# EAGLE schematic node4-frontend (EAGLE 4.16)
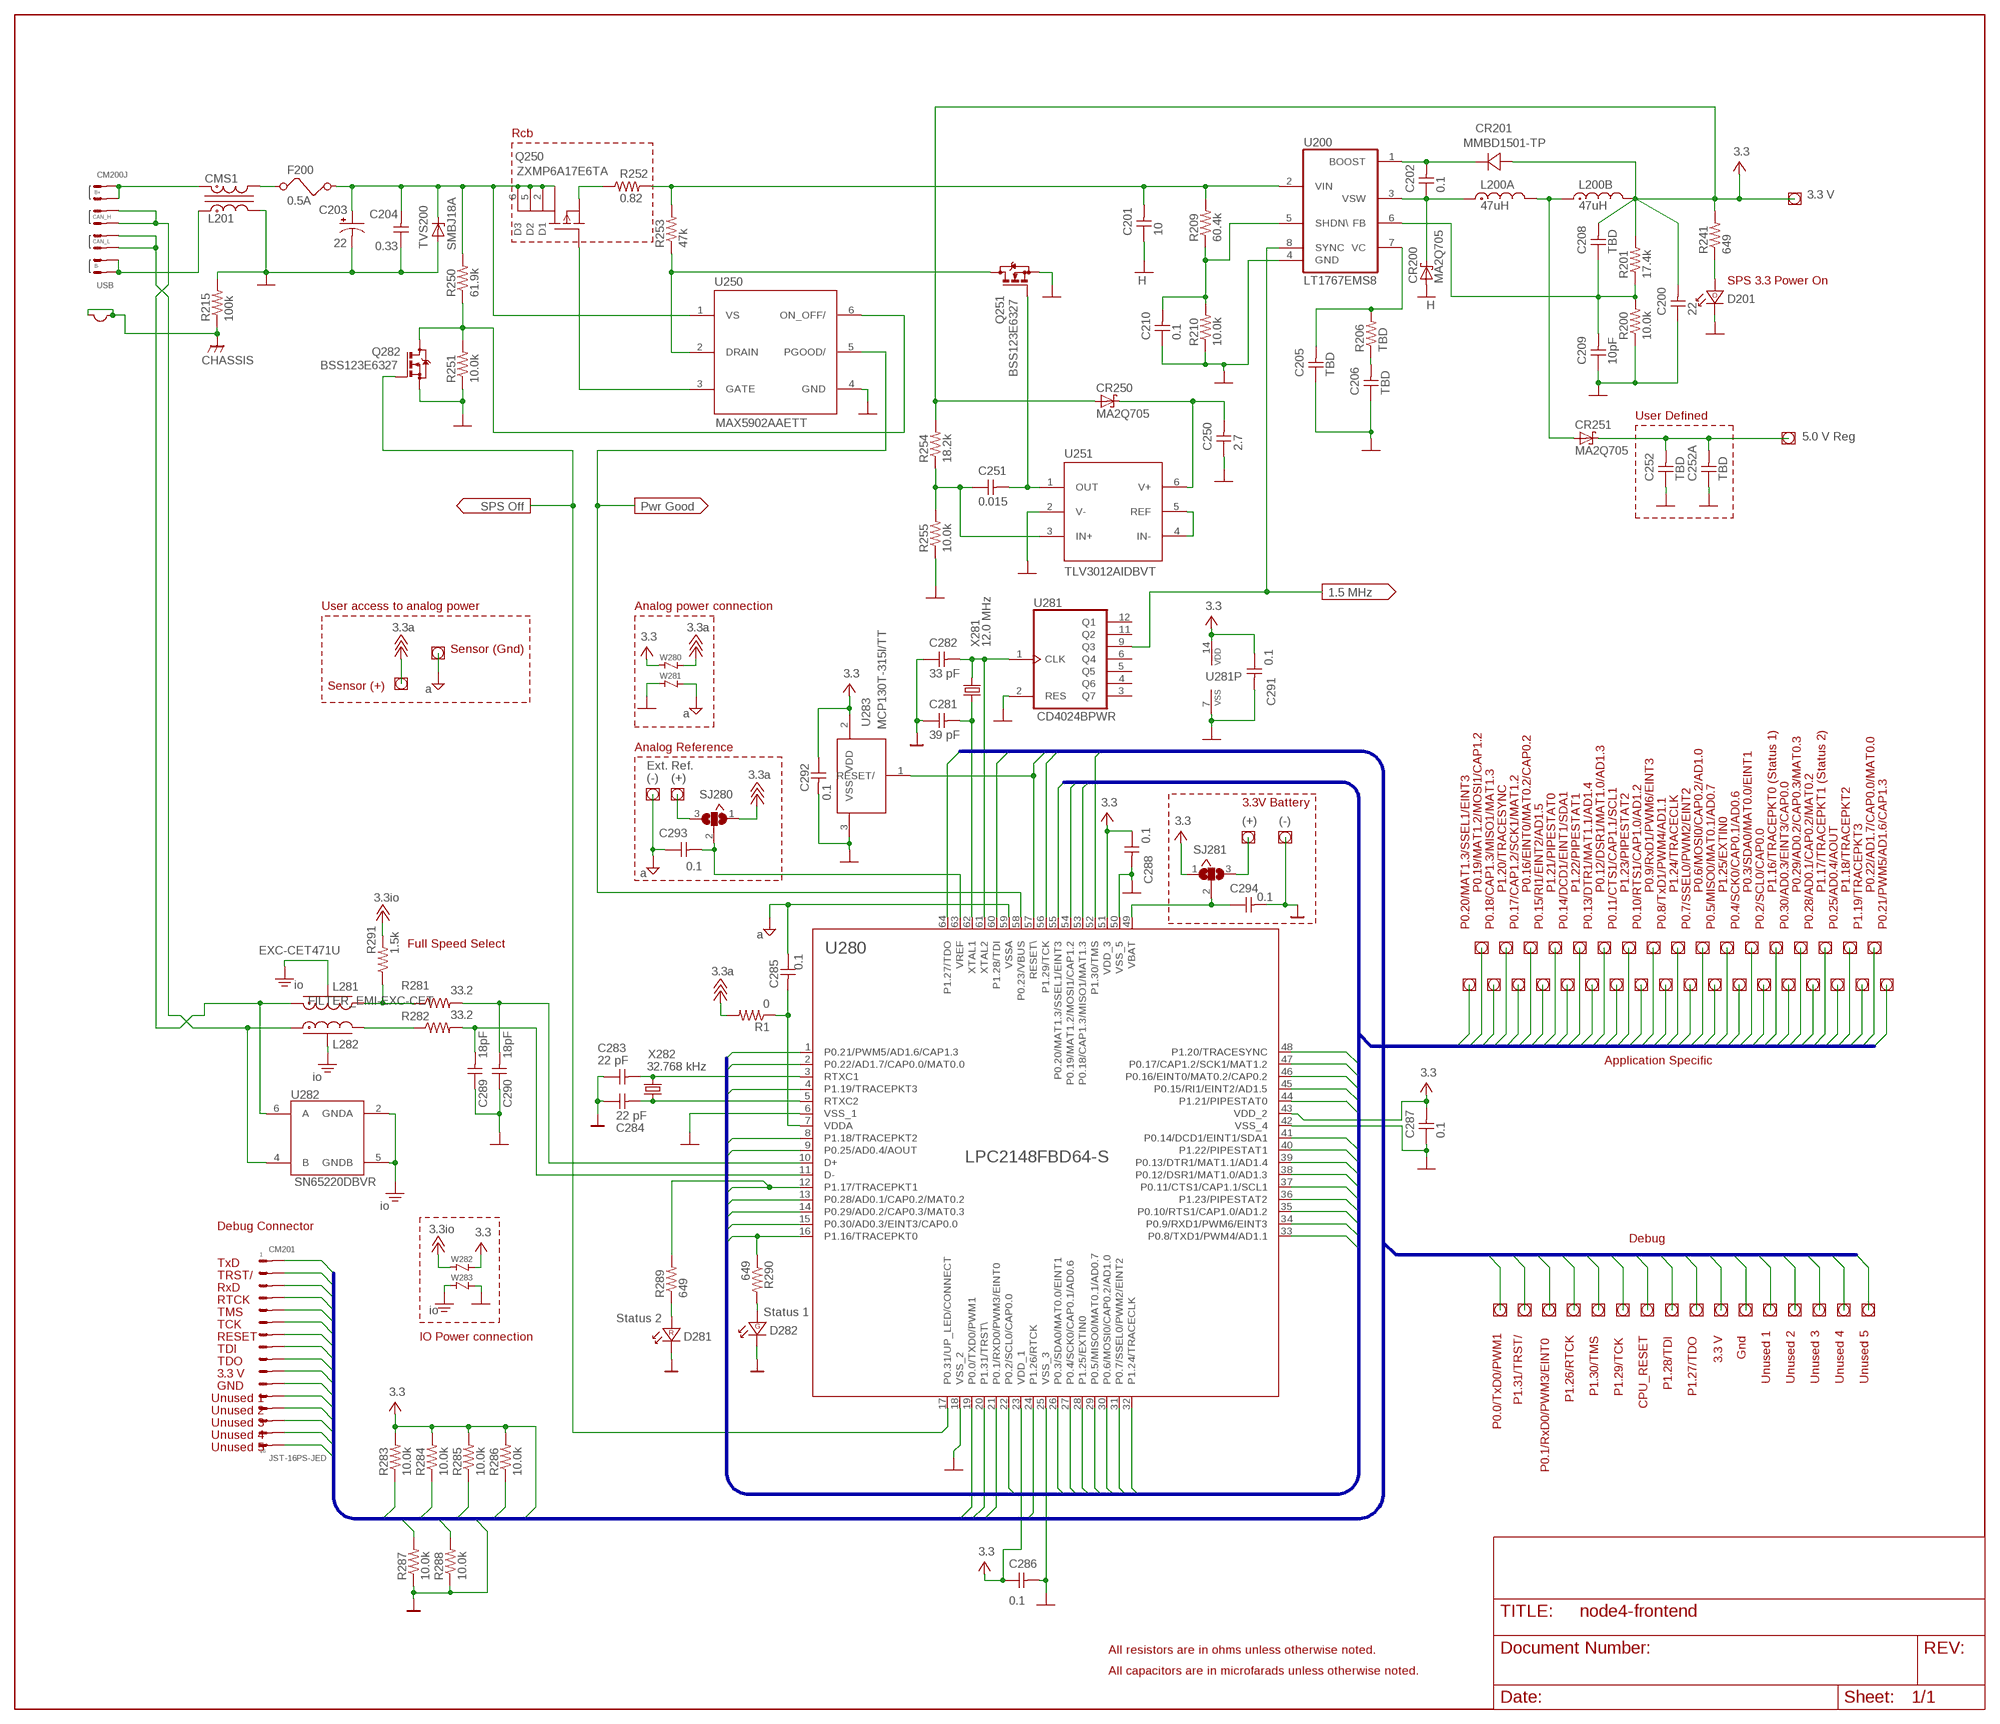
[diagram p0: schematic, sheet 1]

## Parts
3P3  3P3  CONN_JUMPPOINT  [PAD_SQUARE_APC-FREE_0.1/028]
C200  22  CAP-NP0805  [C0805]
C201  10  CAP-NP1206  [C1206]
C202  0.1  CAP-NP0805  [C0805]
C203  22  CPOL-USD/7343-31R  [D/7343-31R]
C204  0.33  CAP-NP0805  [C0805]
C205  TBD  CAP-NP0805  [C0805]
C206  TBD  CAP-NP0805  [C0805]
C208  TBD  CAP-NP0805  [C0805]
C209  10pF  CAP-NP0805  [C0805]
C210  0.1  CAP-NP0805  [C0805]
C250  2.7  CAP-NP0805  [C0805]
C251  0.015  CAP-NP0805  [C0805]
C252  TBD  CAP-NP0805  [C0805]
C252A  TBD  CAP-NP1206  [C1206]
C281  39 pF  CAP-NP0805  [C0805]
C282  33 pF  CAP-NP0805  [C0805]
C283  22 pF  CAP-NP0805  [C0805]
C284  22 pF  CAP-NP0805  [C0805]
C285  0.1  CAP-NP0805  [C0805]
C286  0.1  CAP-NP0805  [C0805]
C287  0.1  CAP-NP0805  [C0805]
C288  0.1  CAP-NP0805  [C0805]
C289  18pF  CAP-NP0805  [C0805]
C290  18pF  CAP-NP0805  [C0805]
C291  0.1  CAP-NP0805  [C0805]
C292  0.1  CAP-NP0805  [C0805]
C293  0.1  CAP-NP0805  [C0805]
C294  0.1  CAP-NP0805  [C0805]
CM200  USB  CONN_CAN_NODE  [CAN_NODE]
CM201  JST-16PS-JED  [JST-16PS-JED]
CR200  MA2Q705  [NMINIP2-J1]
CR201  MMBD1501-TP  DIODE_MMBD1501-TP  [SOT23-3]
CR250  MA2Q705  [NMINIP2-J1]
CR251  MA2Q705  [NMINIP2-J1]
D201  LED-ORG-0805  [0805-DIODE]
D281  LED-RED-0603  [0603-DIODE]
D282  LED-GRN-  [0603-DIODE]
F200  0.5A  FUSE1206  [1206]
L200A  47uH  COIL_SD31  [SD31]
L200B  47uH  COIL_SD31  [SD31]
L201  CMS1  COIL_CMS1  [CMS1]
L281  EXC-CET471U  FILTER_EMI-EXC-CET  [EXC-CET]
L282  FILTER_EMI-EXC-CET  [EXC-CET]
Q250  ZXMP6A17E6TA  FET_ZXMP6A17E6  [SOT23-6]
Q251  BSS123E6327  IC_BSS123  [SOT23-3]
Q282  BSS123E6327  IC_BSS123  [SOT23-3]
R1  0  R-US_R0805  [R0805]
R200  10.0k  R-US_R0805  [R0805]
R201  17.4k  R-US_R0805  [R0805]
R206  TBD  R-US_R0805  [R0805]
R209  60.4k  R-US_R0805  [R0805]
R210  10.0k  R-US_R0805  [R0805]
R215  100k  R-US_R0805  [R0805]
R241  649  R-US_M0805  [M0805]
R250  61.9k  R-US_R0805  [R0805]
R251  10.0k  R-US_R0805  [R0805]
R252  0.82  R-US_R0805  [R0805]
R253  47k  R-US_R0805  [R0805]
R254  18.2k  R-US_R0805  [R0805]
R255  10.0k  R-US_R0805  [R0805]
R281  33.2  R-US_R0805  [R0805]
R282  33.2  R-US_R0805  [R0805]
R283  10.0k  R-US_R1206  [R1206]
R284  10.0k  R-US_R1206  [R1206]
R285  10.0k  R-US_R1206  [R1206]
R286  10.0k  R-US_R1206  [R1206]
R287  10.0k  R-US_R1206  [R1206]
R288  10.0k  R-US_R1206  [R1206]
R289  649  R-US_R1206  [R1206]
R290  649  R-US_R1206  [R1206]
R291  1.5k  R-US_R0805  [R0805]
RA1  t24  CONN_JUMPPOINT  [PAD_SQUARE_APC-FREE_0.1/028]
RA2  t24  CONN_JUMPPOINT  [PAD_SQUARE_APC-FREE_0.1/028]
RA3  t24  CONN_JUMPPOINT  [PAD_SQUARE_APC-FREE_0.1/028]
RA4  Sensor (+)  CONN_JUMPPOINT  [PAD_SQUARE_APC-FREE_0.1/028]
RA5  t24  CONN_JUMPPOINT  [PAD_SQUARE_APC-FREE_0.1/028]
RA6  t24  CONN_JUMPPOINT  [PAD_SQUARE_APC-FREE_0.1/028]
RA7  t24  CONN_JUMPPOINT  [PAD_SQUARE_APC-FREE_0.1/028]
RA8  t24  CONN_JUMPPOINT  [PAD_SQUARE_APC-FREE_0.1/028]
RA9  t24  CONN_JUMPPOINT  [PAD_SQUARE_APC-FREE_0.1/028]
RA10  t24  CONN_JUMPPOINT  [PAD_SQUARE_APC-FREE_0.1/028]
RA11  t24  CONN_JUMPPOINT  [PAD_SQUARE_APC-FREE_0.1/028]
RA12  t24  CONN_JUMPPOINT  [PAD_SQUARE_APC-FREE_0.1/028]
RA13  t24  CONN_JUMPPOINT  [PAD_SQUARE_APC-FREE_0.1/028]
RA14  t24  CONN_JUMPPOINT  [PAD_SQUARE_APC-FREE_0.1/028]
RA15  t24  CONN_JUMPPOINT  [PAD_SQUARE_APC-FREE_0.1/028]
RA16  t24  CONN_JUMPPOINT  [PAD_SQUARE_APC-FREE_0.1/028]
RA17  t24  CONN_JUMPPOINT  [PAD_SQUARE_APC-FREE_0.1/028]
RA18  t24  CONN_JUMPPOINT  [PAD_SQUARE_APC-FREE_0.1/028]
RA19  t24  CONN_JUMPPOINT  [PAD_SQUARE_APC-FREE_0.1/028]
RA20  t24  CONN_JUMPPOINT  [PAD_SQUARE_APC-FREE_0.1/028]
RA21  t24  CONN_JUMPPOINT  [PAD_SQUARE_APC-FREE_0.1/028]
RA22  t24  CONN_JUMPPOINT  [PAD_SQUARE_APC-FREE_0.1/028]
RA23  t24  CONN_JUMPPOINT  [PAD_SQUARE_APC-FREE_0.1/028]
RA24  t24  CONN_JUMPPOINT  [PAD_SQUARE_APC-FREE_0.1/028]
RA25  t24  CONN_JUMPPOINT  [PAD_SQUARE_APC-FREE_0.1/028]
RA26  t24  CONN_JUMPPOINT  [PAD_SQUARE_APC-FREE_0.1/028]
RA27  t24  CONN_JUMPPOINT  [PAD_SQUARE_APC-FREE_0.1/028]
RA28  t24  CONN_JUMPPOINT  [PAD_SQUARE_APC-FREE_0.1/028]
RA29  t24  CONN_JUMPPOINT  [PAD_SQUARE_APC-FREE_0.1/028]
RA30  t24  CONN_JUMPPOINT  [PAD_SQUARE_APC-FREE_0.1/028]
RA31  t24  CONN_JUMPPOINT  [PAD_SQUARE_APC-FREE_0.1/028]
RA32  t24  CONN_JUMPPOINT  [PAD_SQUARE_APC-FREE_0.1/028]
RA33  t24  CONN_JUMPPOINT  [PAD_SQUARE_APC-FREE_0.1/028]
RA34  t24  CONN_JUMPPOINT  [PAD_SQUARE_APC-FREE_0.1/028]
RA35  t24  CONN_JUMPPOINT  [PAD_SQUARE_APC-FREE_0.1/028]
RA36  t24  CONN_JUMPPOINT  [PAD_SQUARE_APC-FREE_0.1/028]
RA37  t24  CONN_JUMPPOINT  [PAD_SQUARE_APC-FREE_0.1/028]
RA38  t24  CONN_JUMPPOINT  [PAD_SQUARE_APC-FREE_0.1/028]
RA39  t24  CONN_JUMPPOINT  [PAD_SQUARE_APC-FREE_0.1/028]
RA40  t24  CONN_JUMPPOINT  [PAD_SQUARE_APC-FREE_0.1/028]
RA41  t24  CONN_JUMPPOINT  [PAD_SQUARE_APC-FREE_0.1/028]
RA42  t24  CONN_JUMPPOINT  [PAD_SQUARE_APC-FREE_0.1/028]
RA43  t24  CONN_JUMPPOINT  [PAD_SQUARE_APC-FREE_0.1/028]
RA44  t24  CONN_JUMPPOINT  [PAD_SQUARE_APC-FREE_0.1/028]
RA45  t24  CONN_JUMPPOINT  [PAD_SQUARE_APC-FREE_0.1/028]
RA46  t24  CONN_JUMPPOINT  [PAD_SQUARE_APC-FREE_0.1/028]
RA47  t24  CONN_JUMPPOINT  [PAD_SQUARE_APC-FREE_0.1/028]
RA48  t24  CONN_JUMPPOINT  [PAD_SQUARE_APC-FREE_0.1/028]
RA49  t24  CONN_JUMPPOINT  [PAD_SQUARE_APC-FREE_0.1/028]
RA50  t24  CONN_JUMPPOINT  [PAD_SQUARE_APC-FREE_0.1/028]
RA51  t24  CONN_JUMPPOINT  [PAD_SQUARE_APC-FREE_0.1/028]
RA52  t24  CONN_JUMPPOINT  [PAD_SQUARE_APC-FREE_0.1/028]
RA53  t24  CONN_JUMPPOINT  [PAD_SQUARE_APC-FREE_0.1/028]
RA54  t24  CONN_JUMPPOINT  [PAD_SQUARE_APC-FREE_0.1/028]
RA55  t24  CONN_JUMPPOINT  [PAD_SQUARE_APC-FREE_0.1/028]
RA56  t24  CONN_JUMPPOINT  [PAD_SQUARE_APC-FREE_0.1/028]
RA57  t24  CONN_JUMPPOINT  [PAD_SQUARE_APC-FREE_0.1/028]
RA58  t24  CONN_JUMPPOINT  [PAD_SQUARE_APC-FREE_0.1/028]
SJ280  JUMPER_SJ2WSJ_2W_DEF  [SJ_2W]
SJ281  JUMPER_SJ2WSJ_2W_DEF  [SJ_2W]
TVS200  SMBJ18A  ZENER-DIODESMB  [SMB]
U200  LT1767EMS8  [MSOP8]
U250  MAX5902AAETT  IC_MAX5902  [SOT23-6]
U251  TLV3012AIDBVT  IC_TLV3012  [SOT23-6]
U280  LPC2148FBD64-S  IC_LPC2148  [TQFP64-10X10]
U281  CD4024BPWR  IC_CD4024PW  [TSSOP-14]
U282  SN65220DBVR  IC_SN65220  [SOT23-6]
U283  MCP130T-315I/TT  IC_MCP130  [SOT23-3]
W280  JUMPER_ZEROOHM1206  [ZJ-1206]
W281  JUMPER_ZEROOHM1206  [ZJ-1206]
W282  JUMPER_ZEROOHM1206  [ZJ-1206]
W283  JUMPER_ZEROOHM1206  [ZJ-1206]
X281  12.0 MHz  XTAL_CS10  [CS10]
X282  32.768 kHz  XTAL_CM415  [CM415]

## Nets
A_3P3: R1.2 RA4.PAD(TP) SJ280.1 W280.2 ; supply symbol labelled 3.3a
A_3P3_CPU: C285.2 R1.1 U280.7(VDDA)
A_GND: C285.1 C293.1 RA9.PAD(TP) RA58.PAD(TP) U280.59(VSSA) W281.2 ; supply symbol labelled a
B+: CM200.B+@1(J:B+1) CM200.B+@2(J:B+2) L201.1
B-: CM200.B-@7(J:B-1) CM200.B-@8(J:B-2) L201.4
BIN: F200.1 L201.2
BOOST: C202.2 CR201.3(CATHODE) U200.1(BOOST)
CHASSIS: CM200.CHASSIS@1 CM200.CHASSIS@2 R215.1
CPU_D+: C290.2 R281.2 U280.10(D+)
CPU_D-: C289.2 R282.2 U280.11(D-)
CPU_PGOOD: U250.5(PGOOD/) U280.58(P0.23/VBUS)
CPU_RESET\: CM201.7 RA42.PAD(TP) U280.57(RESET\) U283.1(RESET/)
CPU_SPS_OFF: Q282.1(G) U280.17(P0.31/UP_LED/CONNECT)
CPU_VBAT: C294.1 SJ281.2 U280.49(VBAT)
CPU_VREF: C293.2 SJ280.2 U280.63(VREF)
CPU_XTAL1: C281.2 U280.62(XTAL1) X281.P$1
CPU_XTAL2: C282.2 U280.61(XTAL2) U281.1(CLK) X281.P$2
D+: L281.2 R281.1 R291.1
D-: L282.2 R282.1
DEBUG11: CM201.12 RA52.PAD(TP)
DEBUG12: CM201.13 RA53.PAD(TP)
DEBUG13: CM201.14 RA54.PAD(TP)
DEBUG14: CM201.15 RA55.PAD(TP)
DEBUG15: CM201.16 RA56.PAD(TP)
EXT_VBAT: RA6.PAD(TP) SJ281.3
EXT_VREF: RA7.PAD(TP) SJ280.3
FB: C208.1 C209.2 R200.2 R201.1 U200.6(FB)
GND: C200.1 C201.1 C203.- C204.1 C205.1 C206.1 C209.1 C210.1 C250.1 C252.1 C252A.1 C281.1 C282.1 C283.1 C284.1 C286.2 C287.1 C288.2 C289.1 C290.1 C291.2 C292.2 C294.2 CM201.11 CR200.A D201.2(CATHODE)(CATHODE) D281.K(CATHODE) D282.K(CATHODE) L201.3 Q251.2(S) Q282.2(S) R200.1 R210.1 R215.2 R251.1 R255.1 R287.1 R288.1 RA51.PAD(TP) RA57.PAD(TP) TVS200.A U200.4(GND) U250.4(GND) U251.2(V-) U280.6(VSS_1) U280.18(VSS_2) U280.25(VSS_3) U280.42(VSS_4) U280.50(VSS_5) U281.2(RES) U281.7(VSS) U283.3(VSS) W281.1 W283.2
I_SENSE: Q250.4(S) R252.1
IN+: C251.1 R254.1 R255.2 U251.3(IN+)
IO_3P3: R291.2 W282.1 ; supply symbol labelled 3.3io
IO_GND: L281.C(COMMON) L282.C(COMMON) U282.2(GNDA) U282.5(GNDB) W283.1 ; supply symbol labelled io
LED200_A: D282.A(ANODE) R290.2
MAX_UVLO: Q282.3(D) R250.1 R251.2 U250.6(ON_OFF/)
N_DRAIN: Q251.3(D) R253.1 U250.2(DRAIN)
N_GATE: C251.2 Q251.1(G) U251.1(OUT)
P0.0/TXD0/PWM1: CM201.1 RA36.PAD(TP) U280.19(P0.0/TXD0/PWM1)
P0.1/RXD0/PWM3/EINT0: CM201.3 RA38.PAD(TP) U280.21(P0.1/RXD0/PWM3/EINT0)
P0.2/SCL0/CAP0.0: RA32.PAD(TP) U280.22(P0.2/SCL0/CAP0.0)
P0.3/SDA0/MAT0.0/EINT1: RA44.PAD(TP) U280.26(P0.3/SDA0/MAT0.0/EINT1)
P0.4/SCK0/CAP0.1/AD0.6: RA31.PAD(TP) U280.27(P0.4/SCK0/CAP0.1/AD0.6)
P0.5/MISO0/MAT0.1/AD0.7: RA30.PAD(TP) U280.29(P0.5/MISO0/MAT0.1/AD0.7)
P0.6/MOSI0/CAP0.2/AD1.0: RA29.PAD(TP) U280.30(P0.6/MOSI0/CAP0.2/AD1.0)
P0.7/SSEL0/PWM2/EINT2: RA19.PAD(TP) U280.31(P0.7/SSEL0/PWM2/EINT2)
P0.8/TXD1/PWM4/AD1.1: RA18.PAD(TP) U280.33(P0.8/TXD1/PWM4/AD1.1)
P0.9/RXD1/PWM6/EINT3: RA27.PAD(TP) U280.34(P0.9/RXD1/PWM6/EINT3)
P0.10/RTS1/CAP1.0/AD1.2: RA17.PAD(TP) U280.35(P0.10/RTS1/CAP1.0/AD1.2)
P0.11/CTS1/CAP1.1/SCL1: RA16.PAD(TP) U280.37(P0.11/CTS1/CAP1.1/SCL1)
P0.12/DSR1/MAT1.0/AD1.3: RA25.PAD(TP) U280.38(P0.12/DSR1/MAT1.0/AD1.3)
P0.13/DTR1/MAT1.1/AD1.4: RA15.PAD(TP) U280.39(P0.13/DTR1/MAT1.1/AD1.4)
P0.14/DCD1/EINT1/SDA1: RA14.PAD(TP) U280.41(P0.14/DCD1/EINT1/SDA1)
P0.15/RI1/EINT2/AD1.5: RA13.PAD(TP) U280.45(P0.15/RI1/EINT2/AD1.5)
P0.16/EINT0/MAT0.2/CAP0.2: RA22.PAD(TP) U280.46(P0.16/EINT0/MAT0.2/CAP0.2)
P0.17/CAP1.2/SCK1/MAT1.2: RA12.PAD(TP) U280.47(P0.17/CAP1.2/SCK1/MAT1.2)
P0.18/CAP1.3/MISO1/MAT1.3: RA11.PAD(TP) U280.53(P0.18/CAP1.3/MISO1/MAT1.3)
P0.19/MAT1.2/MOSI1/CAP1.2: RA20.PAD(TP) U280.54(P0.19/MAT1.2/MOSI1/CAP1.2)
P0.20/MAT1.3/SSEL1/EINT3: RA10.PAD(TP) U280.55(P0.20/MAT1.3/SSEL1/EINT3)
P0.21/PWM5/AD1.6/CAP1.3: RA3.PAD(TP) U280.1(P0.21/PWM5/AD1.6/CAP1.3)
P0.22/AD1.7/CAP0.0/MAT0.0: RA2.PAD(TP) U280.2(P0.22/AD1.7/CAP0.0/MAT0.0)
P0.25/AD0.4/AOUT: RA35.PAD(TP) U280.9(P0.25/AD0.4/AOUT)
P0.28/AD0.1/CAP0.2/MAT0.2: RA34.PAD(TP) U280.13(P0.28/AD0.1/CAP0.2/MAT0.2)
P0.29/AD0.2/CAP0.3/MAT0.3: RA46.PAD(TP) U280.14(P0.29/AD0.2/CAP0.3/MAT0.3)
P0.30/AD0.3/EINT3/CAP0.0: RA33.PAD(TP) U280.15(P0.30/AD0.3/EINT3/CAP0.0)
P1.16/TRACEPKT0: R290.1 RA45.PAD(TP) U280.16(P1.16/TRACEPKT0)
P1.17/TRACEPKT1: R289.2 RA47.PAD(TP) U280.12(P1.17/TRACEPKT1)
P1.18/TRACEPKT2: RA48.PAD(TP) U280.8(P1.18/TRACEPKT2)
P1.19/TRACEPKT3: RA1.PAD(TP) U280.4(P1.19/TRACEPKT3)
P1.20/TRACESYNC: RA21.PAD(TP) U280.48(P1.20/TRACESYNC)
P1.21/PIPESTAT0: RA23.PAD(TP) U280.44(P1.21/PIPESTAT0)
P1.22/PIPESTAT1: RA24.PAD(TP) U280.40(P1.22/PIPESTAT1)
P1.23/PIPESTAT2: RA26.PAD(TP) U280.36(P1.23/PIPESTAT2)
P1.24/TRACECLK: RA28.PAD(TP) U280.32(P1.24/TRACECLK)
P1.25/EXTIN0: RA43.PAD(TP) U280.28(P1.25/EXTIN0)
P1.26/RTCK: CM201.4 R287.2 RA39.PAD(TP) U280.24(P1.26/RTCK)
P1.27/TDO: CM201.9 R286.1 RA49.PAD(TP) U280.64(P1.27/TDO)
P1.28/TDI: CM201.8 R285.1 RA5.PAD(TP) U280.60(P1.28/TDI)
P1.29/TCK: CM201.6 R288.2 RA41.PAD(TP) U280.56(P1.29/TCK)
P1.30/TMS: CM201.5 R284.1 RA40.PAD(TP) U280.52(P1.30/TMS)
P1.31/TRST\: CM201.2 R283.1 RA37.PAD(TP) U280.20(P1.31/TRST\)
P_GATE: Q250.3(G) U250.3(GATE)
PIC_LAMP: D281.A(ANODE) R289.1
REF: U251.4(IN-) U251.5(REF)
RTXC1: C283.2 U280.3(RTXC1) X282.P$2
RTXC2: C284.2 U280.5(RTXC2) X282.P$1
SHDN\: C210.2 R209.1 R210.2 U200.5(SHDN\)
SPS_3P3: 3P3.PAD(TP) C200.2 C208.2 C286.1 C287.2 C288.1 C291.1 C292.1 CM201.10 CR201.1(ANODE) CR250.A L200B.2 R201.2 R241.2 R254.2 R283.2 R284.2 R285.2 R286.2 RA50.PAD(TP) SJ281.1 U280.23(VDD_1) U280.43(VDD_2) U280.51(VDD_3) U281.14(VDD) U283.2(VDD) W280.1 W282.2 ; supply symbol labelled 3.3
SPS_3P3_LED: D201.1(ANODE)(ANODE) R241.1
SPS_5_BUCK_OUT: CR251.A L200A.2 L200B.1
SPS_5_REG: C252.2 C252A.2 CR251.C RA8.PAD(TP)
SPS_SYNC: U200.8(SYNC) U281.9(Q3)
USB+: CM200.CANH@3(J:CAN_H1) CM200.CANH@4(J:CAN_H2) L281.1 U282.6(A)
USB-: CM200.CANL@5(J:CAN_L1) CM200.CANL@6(J:CAN_L2) L282.1 U282.4(B)
V+: C250.2 CR250.C U251.6(V+)
VC: C205.2 R206.2 U200.7(VC)
VC_FLT: C206.2 R206.1
VIN: C201.2 R209.2 R252.2 R253.2 U200.2(VIN)
VS: C203.+ C204.2 F200.2 Q250.1(D) Q250.2(D1) Q250.5(D2) Q250.6(D3) R250.2 TVS200.C U250.1(VS)
VSW: C202.1 CR200.C L200A.1 U200.3(VSW)
Unconnected: U281.3(Q7) U281.4(Q6) U281.5(Q5) U281.6(Q4) U281.11(Q2) U281.12(Q1)

## Buses
DEBUG[0..15]
APP_SPEC[0..34]

## Notes on the sheet
- Rcb
- 3.3 V
- H | SPS 3.3 Power On
- H
- User Defined
- 5.0 V Reg
- User access to analog power | Analog power connection
- Sensor (Gnd)
- Sensor (+)
- Analog Reference
- Ext. Ref.
- (-) | (+)
- 3.3V Battery
- (+) | (-)
- P0.19/MAT1.2/MOSI1/CAP1.2 | P1.20/TRACESYNC | P0.16/EINT0/MAT0.2/CAP0.2 | P1.21/PIPESTAT0 | P1.22/PIPESTAT1 | P0.12/DSR1/MAT1.0/AD1.3 | P1.23/PIPESTAT2 | P0.9/RxD1/PWM6/EINT3 | P1.24/TRACECLK | P0.6/MOSI0/CAP0.2/AD1.0 | P1.25/EXTIN0 | P0.3/SDA0/MAT0.0/EINT1 | P1.16/TRACEPKT0 (Status 1) | P0.29/AD0.2/CAP0.3/MAT0.3 | P1.17/TRACEPKT1 (Status 2) | P1.18/TRACEPKT2 | P0.22/AD1.7/CAP0.0/MAT0.0
- P0.20/MAT1.3/SSEL1/EINT3 | P0.18/CAP1.3/MISO1/MAT1.3 | P0.17/CAP1.2/SCK1/MAT1.2 | P0.15/RI1/EINT2/AD1.5 | P0.14/DCD1/EINT1/SDA1 | P0.13/DTR1/MAT1.1/AD1.4 | P0.11/CTS1/CAP1.1/SCL1 | P0.10/RTS1/CAP1.0/AD1.2 | P0.8/TxD1/PWM4/AD1.1 | P0.7/SSEL0/PWM2/EINT2 | P0.5/MISO0/MAT0.1/AD0.7 | P0.4/SCK0/CAP0.1/AD0.6 | P0.2/SCL0/CAP0.0 | P0.30/AD0.3/EINT3/CAP0.0 | P0.28/AD0.1/CAP0.2/MAT0.2 | P0.25/AD0.4/AOUT | P1.19/TRACEPKT3 | P0.21/PWM5/AD1.6/CAP1.3
- Full Speed Select
- Application Specific
- Debug Connector
- Debug
- TxD
- TRST/
- RxD
- RTCK
- TMS | Status 1
- Status 2
- TCK
- RESET | IO Power connection
- TDI
- Gnd
- TDO | 3.3 V
- 3.3 V
- Unused 1 | Unused 2 | Unused 3 | Unused 4 | Unused 5
- GND | P1.28/TDI
- P1.30/TMS | P1.29/TCK | P1.27/TDO
- Unused 1 | P1.31/TRST/ | P1.26/RTCK
- CPU_RESET
- Unused 2
- Unused 3 | P0.0/TxD0/PWM1
- Unused 4
- Unused 5
- P0.1/RxD0/PWM3/EINT0
- All resistors are in ohms unless otherwise noted.
- All capacitors are in microfarads unless otherwise noted.

## Library data of the parts
3P3 RA1-RA58 = psas_eagle_library:CONN_JUMPPOINT: Something to put in a schematic as a reminder to do something about a pin
C200-C202 C204-C206 C208-C210 = discrete-smd-ipc:CAP-NP
C203 = rcl:CPOL-US: POLARIZED CAPACITOR, American symbol
C250-C252 C252A C281-C294 = node4:CAP-NP
CM200 = psas_eagle_library:CONN_CAN_NODE: PSAS standard CAN node connedtor. (8 pin right angle plug + two strain relief blocks) (The origin of this part should be placed exactly 0.230 inches in from the board edge.)
CM201 = node4:JST-16PS-JED: Connector 16 pin male right angle, JED series, JST corp.
CR200 CR250 CR251 = custom:MA2Q705
CR201 = node4:DIODE_MMBD1501-TP
D201 = psas_eagle_library:LED-ORG-?
D281 = psas_eagle_library:LED-RED-?: Red LED
D282 = psas_eagle_library:LED-GRN-?
F200 = custom:FUSE: Fuse
L200A L200B = node4:COIL_SD31
L201 = psas_eagle_library:COIL_CMS1: Coiltronics CMS1 series common mode choke
L281 L282 = psas_eagle_library:FILTER_EMI: EMI fliter combines RF chokes and capacitor in pi-arrangement
Q250 = node4:FET_ZXMP6A17E6: ZXMP6A17E6 P-channel enhancement mode MOSFET
Q251 Q282 = node4:IC_BSS123: BSS123 N-Channel Enhancement Mode Logic Level MOSFET
R1 R200 R201 R206 R209 R210 R215 R241 R250-R255 R281-R291 = rcl:R-US_: RESISTOR, American symbol
SJ280 SJ281 = node4:JUMPER_SJ2W: SMD solder JUMPER
TVS200 = diode:ZENER-DIODE: Z-Diode
U200 = custom-linear-technology:LT1767: LT1767 Step Down Regulator
U250 = node4:IC_MAX5902: MAX5902 Hot swap controller
U251 = node4:IC_TLV3012: TLV3012 Nano power comparator with voltage reference
U280 = psas_eagle_library:IC_LPC2148: Single-chip 16-bit/32-bit microcontroller ARM7 Full-speed USB 2.0
U281 = node4:IC_CD4024: 7-stage binary/ripple COUNTER
U282 = node4:IC_SN65220: SN65220 USB port transient suppressor
U283 = node4:IC_MCP130: MCP130 Microcontroller supervisory circuit
W280-W283 = psas_eagle_library:JUMPER_ZEROOHM: Cuttable surface mount jumper sized for surface mount devices
X281 = node4:XTAL_CS10: CS10 Surface mount crystal
X282 = node4:XTAL_CM415: CM415 Surface mount crystal